# Altium project RX8 GPS engine.PrjPcb
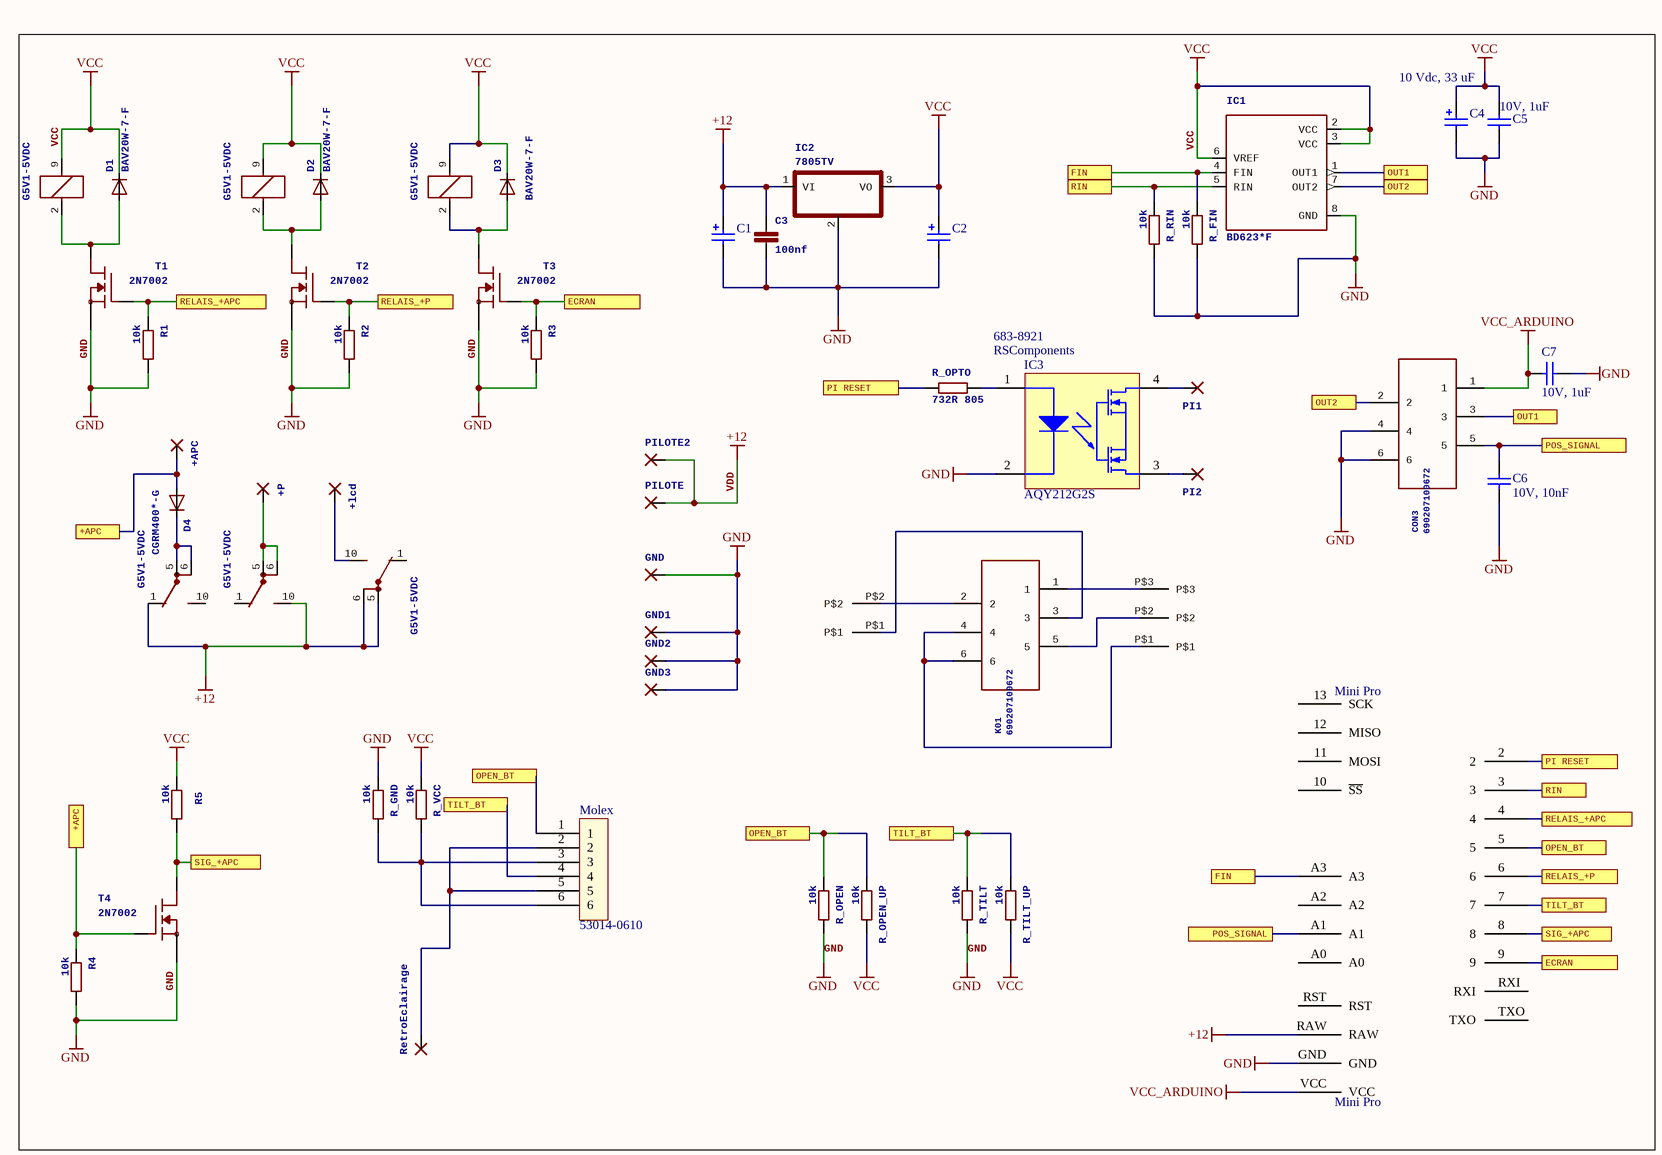
[diagram p0: RX8 GPS engine.SchDoc]
1 sheet, 53 parts. Net scope: flat (ports and power ports of the same name join across sheets).
Board file: RX8 GPS engine.PcbDoc

## Sheet RX8 GPS engine.SchDoc
size 289 x 197 mm

### Parts
+APC  2,54/0,8  [2,54/0,8]  (value not drawn)  (no BOM)
+lcd  2,54/0,8  [2,54/0,8]  (value not drawn)  (no BOM)
+P  2,54/0,8  [2,54/0,8]  (value not drawn)  (no BOM)
C1  16 Vdc, 330 uF  [WCAP-ATG8_8x11.5x3.5]  (value not drawn)
C2  16 Vdc, 330 uF  [WCAP-ATG8_8x11.5x3.5]  (value not drawn)
C3  100nf  [C0805]
C4  10 Vdc, 33 uF  [WCAP-ATG8_5x11x2]
C5  10V, 1uF  [0805_2x1.25x1.25mm_Reflow Soldering]
C6  10V, 10nF  [0805_2x1.25x1.25mm_Reflow Soldering]
C7  10V, 1uF  [0805_2x1.25x1.25mm_Reflow Soldering]
CON3  690207100672  [690207100672]
D1  BAV20W-7-F  [SOD-123_MINI-SMA]
D2  BAV20W-7-F  [SOD-123_MINI-SMA]
D3  BAV20W-7-F  [SOD-123_MINI-SMA]
D4  CGRM400*-G  [SMA]
GND  2,54/0,8  [2,54/0,8]  (value not drawn)  (no BOM)
GND1  2,54/0,8  [2,54/0,8]  (value not drawn)  (no BOM)
GND2  2,54/0,8  [2,54/0,8]  (value not drawn)  (no BOM)
GND3  2,54/0,8  [2,54/0,8]  (value not drawn)  (no BOM)
IC1  BD623*F  [SOP8]
IC2  7805TV  [TO220V]
IC3  AQY212G2S  Supplier 2: RSComponents  Supplier Part Number 2: 683-8921  [PNSC-SOP4_V]
K1  G5V1-5VDC  [G5V1]  (parts A,B of 2)
K01  690207100672  [690207100672]
K2  G5V1-5VDC  [G5V1]  (parts A,B of 2)
K3  G5V1-5VDC  [G5V1]  (parts A,B of 2)
Mini_Pro  Mini Pro  [ARDUINO Mini Pro]
Molex  53014-0610  [053014-0610]
PI1  2,54/0,8  [2,54/0,8]  (value not drawn)  (no BOM)
PI2  2,54/0,8  [2,54/0,8]  (value not drawn)  (no BOM)
PILOTE  2,54/0,8  [2,54/0,8]  (value not drawn)  (no BOM)
PILOTE2  2,54/0,8  [2,54/0,8]  (value not drawn)  (no BOM)
R1  10k  [R0805]
R2  10k  [R0805]
R3  10k  [R0805]
R4  10k  [R0805]
R5  10k  [R0805]
R_FIN  10k  [R0805]
R_GND  10k  [R0805]
R_OPEN  10k  [R0805]  (no BOM)
R_OPEN_UP  10k  [R0805]
R_OPTO  732R 805  [R0805]
R_RIN  10k  [R0805]
R_TILT  10k  [R0805]  (no BOM)
R_TILT_UP  10k  [R0805]
R_VCC  10k  [R0805]  (no BOM)
RetroEclairage  2,54/0,8  [2,54/0,8]  (value not drawn)  (no BOM)
T1  2N7002  [SOT23]
T2  2N7002  [SOT23]
T3  2N7002  [SOT23]
T4  2N7002  [SOT23]
U_MOT  53047-0210  [53047-0210]  (value not drawn)
U_POT  53047-0310  [53047-0310]  (value not drawn)

### Ports
+APC, ECRAN, FIN, OPEN_BT, OUT1, OUT2, PI RESET, POS_SIGNAL, RELAIS_+APC, RELAIS_+P, RIN, SIG_+APC, TILT_BT

### Nets
GND: C1.2(N) C2.2(N) C3.2 C4.2(N) C5.1 C6.1 C7.1 CON3.4 CON3.6 GND.1(P) GND1.1(P) GND2.1(P) GND3.1(P) IC1.8(GND) IC2.2(GND) IC3.2 Mini_Pro.GND R1.2 R2.2 R3.2 R4.2 R_FIN.2 R_GND.1 R_OPEN.2 R_RIN.2 R_TILT.2 T1.2(S) T2.2(S) T3.2(S) T4.2(S)
VCC: C2.1(P) C4.1(P) C5.2 D1.C D2.C D3.C IC1.2(VCC) IC1.3(VCC) IC1.6(VREF) IC2.3(VO) K1.9 K2.9 K3.9 R5.1 R_OPEN_UP.2 R_TILT_UP.2 R_VCC.1
VCC_ARDUINO: C7.2 CON3.1 Mini_Pro.VCC
VDD: C1.1(P) C3.1 IC2.1(VI) K1.1(O) K2.10(S) K3.5(P) K3.6(P) Mini_Pro.RAW PILOTE.1(P) PILOTE2.1(P)  [also labelled +12]
Net+APC_1: +APC.1(P) D4.A R4.1 T4.1(G) ; port +APC
Net+lcd_1: +lcd.1(P) K3.10(S)
Net+P_1: +P.1(P) K2.5(P) K2.6(P)
NetC6_2: C6.2 CON3.5 Mini_Pro.A1 ; port POS_SIGNAL
NetCON3_2: CON3.2 IC1.7(OUT2) ; port OUT2
NetCON3_3: CON3.3 IC1.1(OUT1) ; port OUT1
NetD1_A: D1.A K1.2 T1.3(D)
NetD2_A: D2.A K2.2 T2.3(D)
NetD3_A: D3.A K3.2 T3.3(D)
NetD4_C: D4.C K1.5(P) K1.6(P)
NetIC1_4: IC1.4(FIN) Mini_Pro.A3 R_FIN.1 ; port FIN
NetIC1_5: IC1.5(RIN) Mini_Pro.3 R_RIN.1 ; port RIN
NetIC3_1: IC3.1 R_OPTO.2
NetIC3_3: IC3.3 PI2.1(P)
NetIC3_4: IC3.4 PI1.1(P)
NetK01_1: K01.1 U_POT.P$3
NetK01_2: K01.2 U_MOT.P$2
NetK01_3: K01.3 U_MOT.P$1
NetK01_4: K01.4 K01.6 U_POT.P$1
NetK01_5: K01.5 U_POT.P$2
NetMini_Pro_2: Mini_Pro.2 R_OPTO.1 ; port PI RESET
NetMini_Pro_4: Mini_Pro.4 R1.1 T1.1(G) ; port RELAIS_+APC
NetMini_Pro_5: Mini_Pro.5 Molex.1 R_OPEN.1 R_OPEN_UP.1 ; port OPEN_BT
NetMini_Pro_6: Mini_Pro.6 R2.1 T2.1(G) ; port RELAIS_+P
NetMini_Pro_7: Mini_Pro.7 Molex.4 R_TILT.1 R_TILT_UP.1 ; port TILT_BT
NetMini_Pro_8: Mini_Pro.8 R5.2 T4.3(D) ; port SIG_+APC
NetMini_Pro_9: Mini_Pro.9 R3.1 T3.1(G) ; port ECRAN
NetMolex_2: Molex.2 Molex.5 RetroEclairage.1(P)
NetMolex_3: Molex.3 Molex.6 R_GND.2 R_VCC.2

Not connected (* = marked no-connect by the designer): K1 10(S); K2 1(O); K3 1(O); Mini_Pro 10(~{SS}) 11(MOSI) 12(MISO) 13(SCK) A0 A2 RST RXI TXO

### Library data of the parts
+APC +lcd +P GND GND1-GND3 PI1 PI2 PILOTE PILOTE2 RetroEclairage = 2,54/0,8: THROUGH-HOLE PAD
C1 C2 = 860010374011: WCAP-ATG8 Aluminum Electrolytic Capacitors, 8x11.5mm, 16 Vdc, 330 uF; Manufacturer: CDE Illinois Capacitor; Manufacturer Part Number: 337CKS025M; Dielectric Material: Aluminium; Capacitance: 330uF; Tolerance: 20%; Ripple Current: 455mA; Life (Hours): 2000Hour; Voltage Rating: 25V; ESR (Equivalent Series Resistance): 703mR; Dissipation Factor: 0.14%; Polarity: Polar; Lead Length: 15mm; ComponentLink1Description: Manufacturer; ComponentLink1URL: http://www.we-online.de; ComponentLink2Description: Datasheet; ComponentLink2URL: http://katalog.we-online.de/pbs/datasheet/860010374011.pdf; Supplier 1: Farnell; Supplier Part Number 1: 1203711; Stock: 1019; Pricing 1: 1=0.267, 10=0.161, 25=0.142, 50=0.127, 100=0.112, 500=0.0937, 1000=0.0773 (EUR); Mount: PCB,Through Hole; Case/Package: Radial; Min Operating Temperature: -40°C; Max Operating Temperature: 85°C; Voltage Rating (DC): 25V; Package Quantity: 500; Packaging: Bulk; Diameter: 8mm; Length: 0.45inch; Height: 11.5mm; Height - Seated (Max): 0.512inch; Lead Pitch: 0.138inch; REACH SVHC: No SVHC; Lead Free: Lead Free
C3 = C-EUC0805: CAPACITOR, European symbol; Manufacturer: KEMET; MPN: C0805C104K5RAC-TU; Dielectric Material: Ceramic; Tolerance: 10%; Voltage Rating (DC): 50V; Dielectric: X7R; Voltage: 500V; Supplier 1: RSComponents; Supplier Part Number 1: 264-4416; Stock: 0; Pricing 1: 25=0.046, 125=0.039, 625=0.034, 1250=0.03 (EUR); Mount: PCB,Surface Mount; Case/Package: 0805; Number of Pins: 2; Case Code (Imperial): 0805; Case Code (Metric): 2012; Contact Plating: Matte,Tin; Min Operating Temperature: -55°C; Max Operating Temperature: 125°C; Capacitance: 100nF; Package Quantity: 1; Packaging: Tape and Reel; Voltage Rating: 50V; Termination: SMD/SMT; Length: 2mm; Height: 0.9mm; Width: 1.2mm; Depth: 1.25mm; Lead Pitch: 0.75mm; Thickness: 0.035inch; Radiation Hardening: No; REACH SVHC: No SVHC
C4 = 860010272002: WCAP-ATG8 Aluminum Electrolytic Capacitors, 5x11mm, 10 Vdc, 33 uF; Manufacturer: Nichicon; Manufacturer Part Number: UMA1A330MDD; Rated Voltage: 10 Vdc; Value: 33 uF; Capacitance: 33uF; Tolerance: 20%; Voltage Rating: 10V; Leakage Current: 3.3uA; Life (Hours): 2000Hour; Ripple Current: 41mA; Lead/Base Style: Straight; Lead Diameter: 0.45mm; ComponentLink1Description: Manufacturer; ComponentLink1URL: http://www.we-online.de; ComponentLink2Description: Datasheet; ComponentLink2URL: http://katalog.we-online.de/pbs/datasheet/860010272002.pdf; Part Number: 860010272002; Published Date: Sep. 2017; Publisher: Wurth Elektronik; Size: 5x11mm; Life Cycle: 2000h; Operating Temperature: -40 °C up to +85 °C; Supplier 1: RSComponents; Supplier Part Number 1: 475-9172; Stock: 100; Pricing 1: 5=0.196, 125=0.174, 500=0.156, 2500=0.138, 5000=0.11 (EUR); Mount: Through Hole; Case/Package: Radial; Min Operating Temperature: -40°C; Max Operating Temperature: 85°C; Termination: Radial; Packaging: Bulk; Voltage Rating (DC): 10V; Package Quantity: 200; Features: General Purpose; Voltage: 10V; Diameter: 5mm; Length: 5mm; Height: 5mm; Lead Pitch: 2mm; Height - Seated (Max): 0.236inch; Radiation Hardening: No
C5 C7 = 885012207022: WCAP-CSGP Ceramic Capacitors, 0805, X7R, 10V, 1uF; Manufacturer: Kyocera AVX; Manufacturer Part Number: 0805ZC105KAT2A; Tolerance: 10%; Insulation Resistance: 100GR; Dissipation Factor: 5%; ComponentLink1Description: Manufacturer; ComponentLink1URL: http://www.we-online.de; ComponentLink2Description: Datasheet; ComponentLink2URL: http://katalog.we-online.de/pbs/datasheet/885012207022.pdf; Supplier 1: RSComponents; Supplier Part Number 1: 1358615; Stock: 0; Pricing 1: 100=0.085, 500=0.079, 1000=0.074 (EUR); Mount: PCB,Surface Mount; Case/Package: 0805; Number of Pins: 2; Case Code (Imperial): 0805; Case Code (Metric): 2012; Contact Plating: Matte,Tin; Min Operating Temperature: -55°C; Max Operating Temperature: 125°C; Capacitance: 1uF; Dielectric: X7R; Voltage Rating: 10V; Voltage Rating (DC): 10V; Packaging: Tape and Reel; Voltage: 10V; Package Quantity: 1; Termination: SMD/SMT; Length: 2.01mm; Height: 1.4mm; Depth: 1.25mm; Width: 1.25mm; Thickness: 0.055inch; Radiation Hardening: No; Lead Free: Lead Free; REACH SVHC: No SVHC
C6 = 885012207022: WCAP-CSGP Ceramic Capacitors, 0805, X7R, 10V, 1uF; Manufacturer: KEMET; Manufacturer Part Number: C0805C103J5RACTU; Tolerance: 5%; Voltage Rating (DC): 50V; Dissipation Factor: 10%; ComponentLink1Description: Manufacturer; ComponentLink1URL: http://www.we-online.de; ComponentLink2Description: Datasheet; ComponentLink2URL: http://katalog.we-online.de/pbs/datasheet/885012207022.pdf; Supplier 1: RSComponents; Supplier Part Number 1: 8029917; Stock: 0; Pricing 1: 500=0.016, 2000=0.014 (EUR); Mount: PCB,Surface Mount; Case/Package: 0805; Number of Pins: 2; Case Code (Imperial): 0805; Case Code (Metric): 2012; Dielectric Material: Ceramic; Contact Plating: Matte,Tin; Min Operating Temperature: -55°C; Max Operating Temperature: 125°C; Capacitance: 10nF; Dielectric: X7R; Packaging: Tape and Reel; Voltage Rating: 50V; Termination: SMD/SMT; Package Quantity: 4000; Voltage: 50V; Length: 2mm; Height: 0.78mm; Depth: 1.25mm; Width: 1.2mm; Thickness: 0.035inch; Lead Pitch: 0.75mm; Radiation Hardening: No; REACH SVHC: No SVHC
CON3 K01 = 690207100672: WR-MM Connector 6 pins; Manufacturer: Wurth; Manufacturer Part Number: 690207100672; Supplier 1: RSComponents; Supplier Part Number 1: 771-8222
D1-D3 = CGRM400*-G: Molded plasitc,JEDEC SOD-123/Mini SMA   Source: Comchip CGRM4001-G.pdf; Manufacturer: Diodes; Forward Current: 200mA; Peak Reverse Current: 15uA; Max Surge Current: 2.5A; Forward Voltage: 1.25V; Recovery Time: 50ns; Max Repetitive Reverse Voltage (Vrrm): 150V; Power Dissipation: 250mW; Element Configuration: Single; Polarity: Standard; Current Rating: 400mA; Capacitance: 5pF; Supplier 1: RSComponents; Supplier Part Number 1: 751-3443; Manufacturer Part Number: BAV20W-7-F; Stock: 680000; Pricing 1: 100=0.028, 500=0.026, 1000=0.025 (EUR); Mount: Surface Mount; Number of Pins: 2; Weight: 0.000353oz; Min Operating Temperature: -65°C; Max Operating Temperature: 150°C; Package Quantity: 3000; Packaging: Tape and Reel; Average Rectified Current: 200mA; Reverse Recovery Time: 50ns; Peak Non-Repetitive Surge Current: 2.5A; Voltage Rating (DC): 150V; Power Rating: 250mW; Output Current: 200mA; Max Reverse Voltage (DC): 150V; Length: 2.85mm; Height: 1.25mm; Width: 1.7mm; Radiation Hardening: No; Lead Free: Lead Free
D4 = CGRM400*-G: Molded plasitc,JEDEC SOD-123/Mini SMA   Source: Comchip CGRM4001-G.pdf; Manufacturer: ON Semiconductor; Manufacturer Part Number: MBR2H200SFT1G; Average Rectified Current: 2A; Max Repetitive Reverse Voltage (Vrrm): 200V; Peak Reverse Current: 200uA; Forward Voltage: 940mV; Max Forward Surge Current (Ifsm): 30A; Element Configuration: Single; Supplier 1: RSComponents; Supplier Part Number 1: 842-7797; Stock: 300000; Pricing 1: 100=0.123, 500=0.105, 1000=0.081 (EUR); Mount: Surface Mount; Case/Package: SOD-123-2; Number of Pins: 2; Weight: 0.000363oz; Min Operating Temperature: -55°C; Max Operating Temperature: 150°C; Packaging: Tape and Reel; Forward Current: 2A; Package Quantity: 3000; Max Reverse Voltage (DC): 200V; Length: 2.9mm; Height: 0.9mm; Width: 1.8mm; REACH SVHC: No SVHC; Lead Free: Lead Free
IC1 = BD623*F: H-bridge driver for brush motors   Source: http://www.rohm.com/products/databook/motor/pdf/bd623x_series-e.pdf; MPN: BD6230F-E2; MF: *; OC_FARNELL: 1716264; OC_NEWARK: 15R0529
IC2 = 78*TV: Positive VOLTAGE REGULATOR   Source: http://cache.national.com/ds/LM/LM78L05.pdf http://www.fairchildsemi.com/ds/LM/LM7805.pdf; Manufacturer: ST Microelectronic; Manufacturer Part Number: L7805ACV; Mount: Through Hole; Supplier 1: RSComponents; Supplier Part Number 1: 295-8508
IC3 = AQY212G2S: PhotoMOS GU SOP 1 Form A High Capacity, 60 V Load Voltage, 1.25 A Continuous Load Current, -40 to 85 degC, 4-Pin SOP, Tube, RoHS; Manufacturer: Omron; Manufacturer Part Number: G3VM-351GL; Max Output Current: 120mA; Max Input Voltage: 1.3V; Max Output Voltage: 350V; Max Input Current: 50mA; On-State Resistance: 35R; Load Current: 110mA; Throw Configuration: SPST; Relay Type: Relay; Isolation Voltage: 1.5kV; Forward Current: 7.5mA; Supplier 1: Farnell; Supplier Part Number 1: 2065737; Stock: 124; Pricing 1: 1=2.04 (EUR); Mount: Surface Mount; Case/Package: SOP; Number of Pins: 4; Min Operating Temperature: -40°C; Max Operating Temperature: 85°C; Packaging: Rail/Tube; Package Quantity: 100; Termination: Gull Wing; Output Current: 120mA; Input Current: 50mA; Output Voltage: 350V; Length: 3.9mm; Height: 1.9mm; Depth: 4.4mm; Width: 3.9mm; Radiation Hardening: No; REACH SVHC: Unknown; Lead Free: Lead Free; Pricing 2: 1=2.36 (EUR)
K1-K3 = G5V1: RELAY   1 x switch, 0.5 A/125 V AC, 1 A/24 V DC , Omron; Manufacturer Part Number: G5V-1-DC5; Contact Current Rating: 1A; Max Voltage Rating (AC): 125V; Max Voltage Rating (DC): 60V; Throw Configuration: SPDT; Coil Current: 30mA; Operate Time: 5ms; Coil Power: 150mW; Coil Resistance: 167R; Coil Type: Non-Latching; Coil Voltage (DC): 5V; Number of Poles: 1; Relay Type: General Purpose; Insulation Resistance: 1GR; Approvals: CSA,UL; Supplier 1: RSComponents; Supplier Part Number 1: 8411420; Manufacturer: Omron; Mount: Through Hole; Case/Package: DIP; Number of Pins: 6; Min Operating Temperature: -40°C; Max Operating Temperature: 70°C; Max Current Rating: 1A; Termination: PC Pin; Power Consumption: 150mW; Package Quantity: 25; Voltage Rating (AC): 125V; Voltage Rating (DC): 60V; Release Time: 5ms; Current Rating: 1A; Type: Electromechanical; Length: 12.5mm; Height: 10mm; Width: 7.5mm; Radiation Hardening: No; REACH SVHC: Unknown; Lead Free: Lead Free; Supplier 2: Farnell; Supplier Part Number 2: 9949577
Mini_Pro = Mini Pro: Arduino mini pro 5V
Molex = 53014-0610: Molex connector for push button; Supplier 1: RSComponents; Supplier Part Number 1: 688-2643; Manufacturer: Molex; Manufacturer Part Number: 53014-0610; Mount: Through Hole; Min Operating Temperature: -20°C; Max Operating Temperature: 85°C; Termination: Solder; Length: 14mm
R1-R5 R_FIN R_OPEN_UP R_RIN R_TILT_UP R_VCC = R-EU_R0805: RESISTOR, European symbol; Manufacturer: Bourns; Manufacturer Part Number: CRT0805-FZ-1002ELF; Resistance: 10kR; Tolerance: 1%; Temperature Coefficient: 50ppm/°C; Power Rating: 125mW; Voltage Rating: 100V; Max Power Dissipation: 100mW; Supplier 1: RSComponents; Supplier Part Number 1: 740-9224; Stock: 17400; Pricing 1: 10=0.089, 250=0.042, 1000=0.037, 5000=0.032, 10000=0.029 (EUR); Mount: Surface Mount; Case/Package: 0805; Case Code (Imperial): 0805; Case Code (Metric): 2012; Min Operating Temperature: -55°C; Max Operating Temperature: 155°C; Packaging: Tape and Reel; Composition: Thin Film; Military Standard: Not; Package Quantity: 1; Number of Terminations: 2; Termination: SMD/SMT; Voltage Rating (DC): 100V; Length: 2mm; Height: 0.55mm; Width: 1.25mm; Depth: 1.25mm; REACH SVHC: No SVHC
  R4: Parameter 1: *
R_GND R_OPEN R_TILT = R-EU_R0805: RESISTOR, European symbol; Manufacturer: Bourns; Manufacturer Part Number: CRT0805-FZ-1002ELF; Resistance: 10kR; Power Rating: 125mW; Tolerance: 1%; Voltage Rating: 100V; Temperature Coefficient: 50ppm/°C; Max Power Dissipation: 100mW; Supplier 1: RSComponents; Supplier Part Number 1: 740-9224; Stock: 17400; Pricing 1: 10=0.089, 250=0.042, 1000=0.037, 5000=0.032, 10000=0.029 (EUR); Mount: Surface Mount; Case/Package: 0805; Case Code (Imperial): 0805; Case Code (Metric): 2012; Min Operating Temperature: -55°C; Max Operating Temperature: 155°C; Packaging: Tape and Reel; Package Quantity: 1; Composition: Thin Film; Termination: SMD/SMT; Number of Terminations: 2; Military Standard: Not; Voltage Rating (DC): 100V; Length: 2mm; Height: 0.55mm; Width: 1.25mm; Depth: 1.25mm; REACH SVHC: No SVHC
R_OPTO = R-EU_R0805: RESISTOR, European symbol; Manufacturer: Panasonic; Manufacturer Part Number: ERA6AEB7320V; Tolerance: 0.1%; Temperature Coefficient: 25ppm/°C; Power Rating: 125mW; Voltage Rating: 200V; Voltage Rating (DC): 100V; Supplier 1: Farnell; Supplier Part Number 1: 1810490; Stock: 1370; Pricing 1: 10=0.219, 100=0.108, 500=0.0877, 1000=0.0663 (EUR); Mount: Surface Mount; Case/Package: 0805; Number of Pins: 2; Case Code (Metric): 2012; Case Code (Imperial): 0805; Contact Plating: Tin; Min Operating Temperature: -55°C; Max Operating Temperature: 155°C; Resistance: 732R; Packaging: Tape and Reel; Composition: Metal Film,Thin Film; Termination: Solder; Package Quantity: 1; Number of Terminations: 2; Max Power Dissipation: 125mW; Features: Automotive AEC-Q200; Military Standard: Not; Length: 2mm; Height: 0.5mm; Width: 1.25mm; Depth: 1.25mm; Radiation Hardening: No; Lead Free: Lead Free; REACH SVHC: No SVHC
T1-T4 = NTR4003NT3G: Transistor; Manufacturer: Diodes; Manufacturer Part Number: 2N7002-7-F; Max Power Dissipation: 300mW; Continuous Drain Current (ID): 115mA; Drain to Source Resistance: 7.5R; Gate to Source Voltage (Vgs): 20V; Nominal Vgs: 2.5V; Number of Elements: 1; Drain to Source Voltage (Vdss): 60V; Drain to Source Breakdown Voltage: 70V; Power Dissipation: 540mW; Element Configuration: Single; Input Capacitance: 50pF; Turn-Off Delay Time: 11ns; Turn-On Delay Time: 7ns; Current: 115A; Rise Time: 3ns; Fall Time: 5.6ns; Supplier 1: RSComponents; Supplier Part Number 1: 7082396; Mount: Surface Mount; Case/Package: SOT-23; Number of Pins: 3; Weight: 0.000282oz; Min Operating Temperature: -55°C; Max Operating Temperature: 150°C; Package Quantity: 3000; Threshold Voltage: 2.5V; Voltage Rating (DC): 60V; Current Rating: 115mA; Rds On Max: 7.5R; Number of Channels: 1; On-State Resistance: 7.5R; Dual Supply Voltage: 60V; Voltage: 60V; Termination: SMD/SMT; Length: 2.9mm; Height: 1mm; Width: 1.3mm; Radiation Hardening: No; REACH SVHC: No SVHC; Lead Free: Lead Free
U_MOT = 53047-0210: Molex Connector for motor; Manufacturer: Molex; Manufacturer Part Number: 53047-0210; Supplier 1: RSComponents; Supplier Part Number 1: 279-9213
U_POT = 53047-0310: Molex connector for position sensor; Manufacturer: Molex; Manufacturer Part Number: 53047-0310; Supplier 1: RSComponents; Supplier Part Number 1: 319-1064